# Altium schematic sheet 40 pin hbridge.SchDoc
size A4
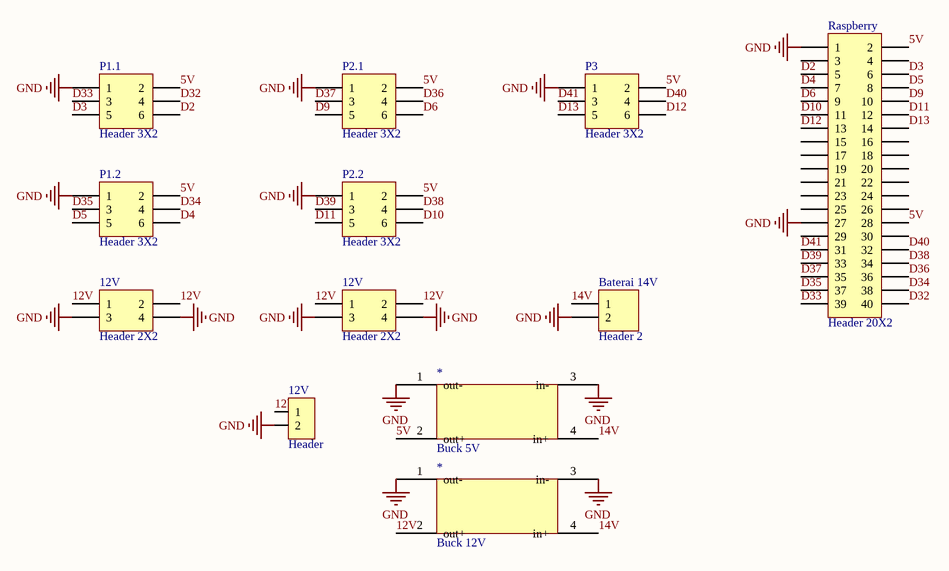
[diagram p0: 40 pin hbridge.SchDoc]

## Parts
(Parts that share a designator on the sheet are numbered #1, #2 ... from top to bottom, then left to right.)
12V#1  Header 2X2  [HDR2X2]
12V#2  Header 2X2  [HDR2X2]
12V#3  Header  [PCBComponent_1]
*#1  Buck 5V  [PCBComponent_1]
*#2  Buck 12V  [PCBComponent_1]
Baterai_14V  Header 2  [HDR1X2]
P1.1  Header 3X2  [HDR2X3]
P1.2  Header 3X2  [HDR2X3]
P2.1  Header 3X2  [HDR2X3]
P2.2  Header 3X2  [HDR2X3]
P3  Header 3X2  [HDR2X3]
Raspberry  Header 20X2  [HDR2X20]

## Nets
GND: 12V#1.3 12V#1.4 12V#2.3 12V#2.4 12V#3.2 *#1.1(out-) *#1.3(in-) *#2.1(out-) *#2.3(in-) Baterai_14V.2 P1.1.1 P1.2.1 P2.1.1 P2.2.1 P3.1 Raspberry.1 Raspberry.27
5V: *#1.2(out+) P1.1.2 P1.2.2 P2.1.2 P2.2.2 P3.2 Raspberry.2 Raspberry.28
12V: 12V#1.1 12V#1.2 12V#2.1 12V#2.2 12V#3.1 *#2.2(out+)
14V: *#1.4(in+) *#2.4(in+) Baterai_14V.1
D2: P1.1.6 Raspberry.5
D3: P1.1.5 Raspberry.6
D4: P1.2.6 Raspberry.7
D5: P1.2.5 Raspberry.8
D6: P2.1.6 Raspberry.9
D9: P2.1.5 Raspberry.10
D10: P2.2.6 Raspberry.11
D11: P2.2.5 Raspberry.12
D12: P3.6 Raspberry.13
D13: P3.5 Raspberry.14
D32: P1.1.4 Raspberry.40
D33: P1.1.3 Raspberry.39
D34: P1.2.4 Raspberry.38
D35: P1.2.3 Raspberry.37
D36: P2.1.4 Raspberry.36
D37: P2.1.3 Raspberry.35
D38: P2.2.4 Raspberry.34
D39: P2.2.3 Raspberry.33
D40: P3.4 Raspberry.32
D41: P3.3 Raspberry.31

Not connected (* = marked no-connect by the designer): Raspberry 3 4 15 16 17 18 19 20 21 22 23 24 25 26 29 30

## Library data of the parts
12V#1 12V#2 = Header 2X2: Header, 2-Pin, Dual row; LatestRevisionDate: 17-Jul-2002; LatestRevisionNote: Re-released for DXP Platform.; Publisher: Altium Limited
12V#3 *#1 *#2 = Component_1
Baterai_14V = Header 2: Header, 2-Pin; LatestRevisionDate: 17-Jul-2002; LatestRevisionNote: Re-released for DXP Platform.; Publisher: Altium Limited
P1.1 P1.2 P2.1 P2.2 P3 = Header 3X2: Header, 3-Pin, Dual row; LatestRevisionDate: 17-Jul-2002; LatestRevisionNote: Re-released for DXP Platform.; Publisher: Altium Limited
Raspberry = Header 20X2: Header, 20-Pin, Dual row; LatestRevisionDate: 17-Jul-2002; LatestRevisionNote: Re-released for DXP Platform.; Publisher: Altium Limited